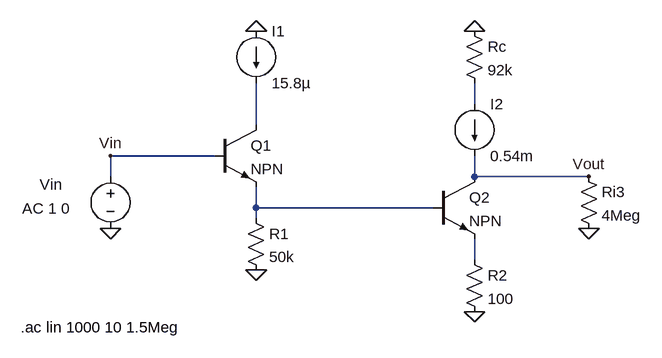
[diagram p0: schematic TP1-EJ11.asc]
TP1-EJ11.asc, the LTspice schematic file:
Version 4
SHEET 1 880 680
WIRE 368 32 368 0
WIRE 32 64 32 0
WIRE -32 112 -192 112
WIRE -192 144 -192 112
WIRE 368 144 368 112
WIRE 544 144 368 144
WIRE 32 192 32 160
WIRE 304 192 32 192
WIRE 32 208 32 192
WIRE 368 272 368 240
FLAG 32 -80 0
FLAG 368 -80 0
FLAG -192 224 0
FLAG 32 288 0
FLAG 544 224 0
FLAG 368 352 0
FLAG 544 144 Vout
FLAG -192 112 Vin
SYMBOL voltage -192 128 R0
WINDOW 0 -109 28 Left 2
WINDOW 123 -136 65 Left 2
WINDOW 39 0 0 Left 0
SYMATTR InstName Vin
SYMATTR Value ""
SYMATTR Value2 AC 1 0
SYMBOL current 32 -80 R0
SYMATTR InstName I1
SYMATTR Value 15.8µ
SYMBOL npn -32 64 R0
SYMATTR InstName Q1
SYMBOL npn 304 144 R0
SYMATTR InstName Q2
SYMBOL res 352 -96 R0
SYMATTR InstName Rc
SYMATTR Value 92k
SYMBOL res 16 192 R0
SYMATTR InstName R1
SYMATTR Value 50k
SYMBOL res 352 256 R0
SYMATTR InstName R2
SYMATTR Value 100
SYMBOL res 528 128 R0
SYMATTR InstName Ri3
SYMATTR Value 4Meg
SYMBOL current 368 32 R0
WINDOW 123 0 0 Left 0
WINDOW 39 0 0 Left 0
SYMATTR InstName I2
SYMATTR Value 0.54m
TEXT -330 376 Left 2 !.ac lin 1000 10 1.5Meg

The netlist it stands for:
* TP1-EJ11.asc
Vin Vin 0 AC 1 0
I1 0 N002 15.8µ
Q1 N002 Vin N003 0 NPN
Q2 Vout N003 N004 0 NPN
Rc 0 N001 92k
R1 N003 0 50k
R2 N004 0 100
Ri3 Vout 0 4Meg
I2 N001 Vout 0.54m
.model NPN NPN
.model PNP PNP
.lib standard.bjt
.ac lin 1000 10 1.5Meg
.backanno
.end